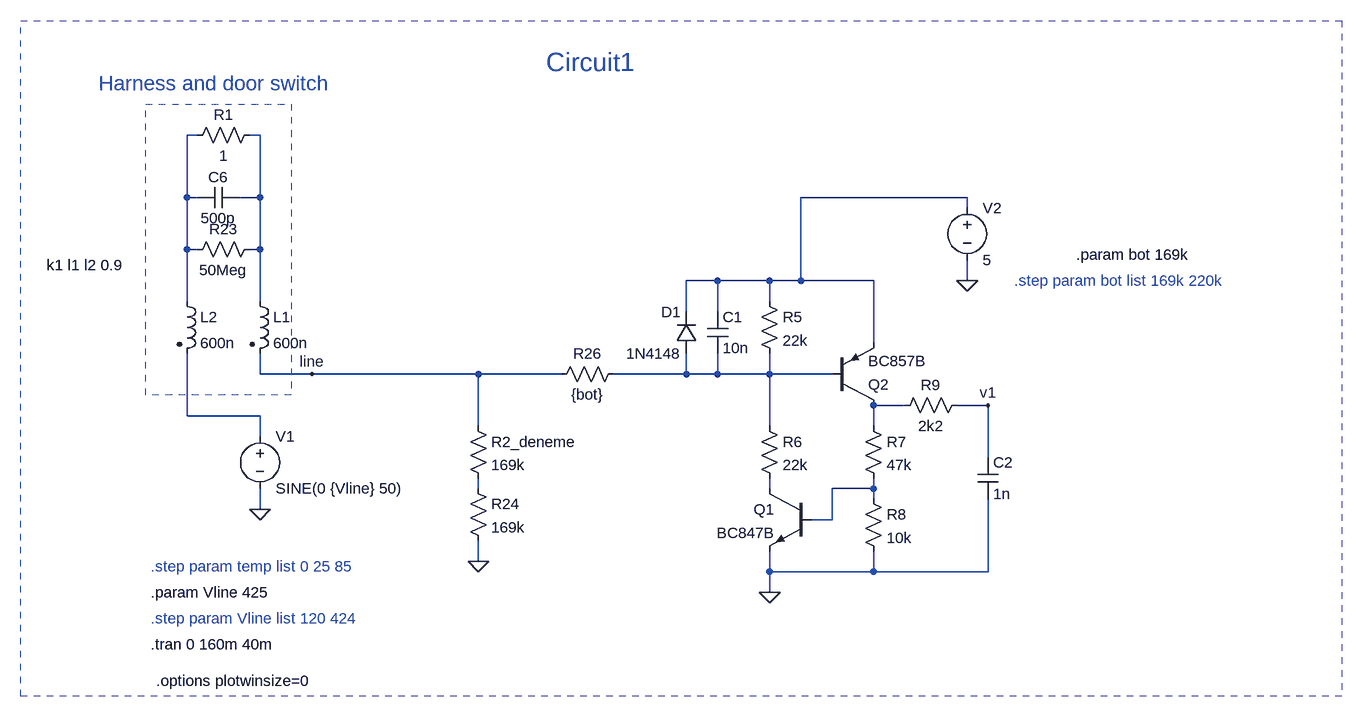
[diagram p0: schematic exampleCircuit.asc]
exampleCircuit.asc, the LTspice schematic file:
Version 4
SHEET 1 2724 1332
WIRE -256 -400 -272 -400
WIRE -160 -400 -176 -400
WIRE -272 -304 -272 -400
WIRE -256 -304 -272 -304
WIRE -160 -304 -160 -400
WIRE -160 -304 -192 -304
WIRE 928 -304 672 -304
WIRE 928 -288 928 -304
WIRE -272 -224 -272 -304
WIRE -256 -224 -272 -224
WIRE -160 -224 -160 -304
WIRE -160 -224 -176 -224
WIRE 544 -176 496 -176
WIRE 624 -176 544 -176
WIRE 672 -176 672 -304
WIRE 672 -176 624 -176
WIRE 784 -176 672 -176
WIRE 928 -176 928 -208
WIRE -272 -144 -272 -224
WIRE -160 -144 -160 -224
WIRE 624 -144 624 -176
WIRE 496 -128 496 -176
WIRE 544 -128 544 -176
WIRE 784 -80 784 -176
WIRE -160 -32 -160 -64
WIRE -80 -32 -160 -32
WIRE 176 -32 -80 -32
WIRE 304 -32 176 -32
WIRE 496 -32 496 -64
WIRE 496 -32 384 -32
WIRE 544 -32 544 -64
WIRE 544 -32 496 -32
WIRE 624 -32 624 -64
WIRE 624 -32 544 -32
WIRE 720 -32 624 -32
WIRE 832 16 784 16
WIRE 960 16 912 16
WIRE -272 32 -272 -64
WIRE -160 32 -272 32
WIRE 176 48 176 -32
WIRE 624 48 624 -32
WIRE 784 48 784 16
WIRE -160 64 -160 32
WIRE 960 96 960 16
WIRE 176 144 176 128
WIRE 624 144 624 128
WIRE 784 144 784 128
WIRE 784 144 720 144
WIRE 784 160 784 144
WIRE -160 176 -160 144
WIRE 720 192 720 144
WIRE 720 192 688 192
WIRE 176 256 176 224
WIRE 624 272 624 240
WIRE 784 272 784 240
WIRE 784 272 624 272
WIRE 960 272 960 160
WIRE 960 272 784 272
WIRE 624 304 624 272
FLAG 624 304 0
FLAG 928 -176 0
FLAG -160 176 0
FLAG -80 -32 line
FLAG 960 16 v1
FLAG 176 256 0
SYMBOL voltage -160 48 R0
WINDOW 123 0 0 Left 0
WINDOW 39 0 0 Left 0
SYMATTR InstName V1
SYMATTR Value SINE(0 {Vline} 50)
SYMBOL diode 512 -64 R180
WINDOW 0 24 64 Left 2
WINDOW 3 24 0 Left 2
SYMATTR InstName D1
SYMATTR Value 1N4148
SYMBOL cap 528 -128 R0
SYMATTR InstName C1
SYMATTR Value 10n
SYMBOL res 608 -160 R0
SYMATTR InstName R5
SYMATTR Value 22k
SYMBOL res 608 32 R0
SYMATTR InstName R6
SYMATTR Value 22k
SYMBOL res 768 32 R0
SYMATTR InstName R7
SYMATTR Value 47k
SYMBOL res 768 144 R0
SYMATTR InstName R8
SYMATTR Value 10k
SYMBOL res 928 0 R90
WINDOW 0 0 56 VBottom 2
WINDOW 3 32 56 VTop 2
SYMATTR InstName R9
SYMATTR Value 2k2
SYMBOL cap 944 96 R0
SYMATTR InstName C2
SYMATTR Value 1n
SYMBOL npn 688 144 M0
SYMATTR InstName Q1
SYMATTR Value BC847B
SYMBOL pnp 720 16 M180
SYMATTR InstName Q2
SYMATTR Value BC857B
SYMBOL voltage 928 -304 R0
WINDOW 123 0 0 Left 0
WINDOW 39 0 0 Left 0
SYMATTR InstName V2
SYMATTR Value 5
SYMBOL res -160 -240 R90
WINDOW 0 0 56 VBottom 2
WINDOW 3 32 56 VTop 2
SYMATTR InstName R23
SYMATTR Value 50Meg
SYMBOL cap -192 -320 R90
WINDOW 0 0 32 VBottom 2
WINDOW 3 32 32 VTop 2
SYMATTR InstName C6
SYMATTR Value 500p
SYMBOL ind2 -176 -160 R0
SYMATTR InstName L1
SYMATTR Value 600n
SYMATTR Type ind
SYMBOL ind2 -288 -160 R0
SYMATTR InstName L2
SYMATTR Value 600n
SYMATTR Type ind
SYMBOL res 160 32 R0
SYMATTR InstName R2_deneme
SYMATTR Value 169k
SYMBOL res 160 128 R0
SYMATTR InstName R24
SYMATTR Value 169k
SYMBOL res 400 -48 R90
WINDOW 0 0 56 VBottom 2
WINDOW 3 32 56 VTop 2
SYMATTR InstName R26
SYMATTR Value {bot}
SYMBOL res -160 -416 R90
WINDOW 0 0 56 VBottom 2
WINDOW 3 32 56 VTop 2
SYMATTR InstName R1
SYMATTR Value 1
TEXT -328 384 Left 2 !.tran 0 160m 40m
TEXT -328 344 Left 2 ;.step param Vline list 120 424
TEXT -328 304 Left 2 !.param Vline 425
TEXT -328 264 Left 2 ;.step param temp list 0 25 85
TEXT 1000 -176 Left 2 ;.step param bot list 169k 220k
TEXT -488 -200 Left 2 !k1 l1 l2 0.9
TEXT 1096 -216 Left 2 !.param bot 169k
TEXT 280 -512 Left 4 ;Circuit1
TEXT -408 -480 Left 3 ;Harness and door switch
TEXT -320 440 Left 2 !.options plotwinsize=0
RECTANGLE Normal -112 0 -336 -448 2
RECTANGLE Normal 1504 464 -528 -576 2

The netlist it stands for:
* exampleCircuit.asc
V1 N006 0 SINE(0 {Vline} 50)
D1 N004 N003 1N4148
C1 N003 N004 10n
R5 N003 N004 22k
R6 N004 N008 22k
R7 N005 N009 47k
R8 N009 0 10k
R9 v1 N005 2k2
C2 v1 0 1n
Q1 N008 N009 0 0 BC847B
Q2 N005 N004 N003 0 BC857B
V2 N003 0 5
R23 N002 N001 50Meg
C6 N002 N001 500p
L1 N002 line 600n
L2 N001 N006 600n
R2_deneme line N007 169k
R24 N007 0 169k
R26 N004 line {bot}
R1 N002 N001 1
.model D D
.lib standard.dio
.model NPN NPN
.model PNP PNP
.lib standard.bjt
.tran 0 160m 40m
* .step param Vline list 120 424
.param Vline 425
* .step param temp list 0 25 85
* .step param bot list 169k 220k
k1 l1 l2 0.9
.param bot 169k
* Circuit1
* Harness and door switch
.options plotwinsize=0
.backanno
.end